# EasyEDA Pro project PrototypeBoardV2A.eprj

# Schematic Schematic1
Board Name: Board1; Create Date: 2025-06-25; Page Name: P1; Project Name: PrototypeBoardV2A; Schematic Name: Schematic1; Update Date: 2025-08-23; Company: m039; Drawn: Dmitry Mozgin; Page Size: A4; Version: V1.0
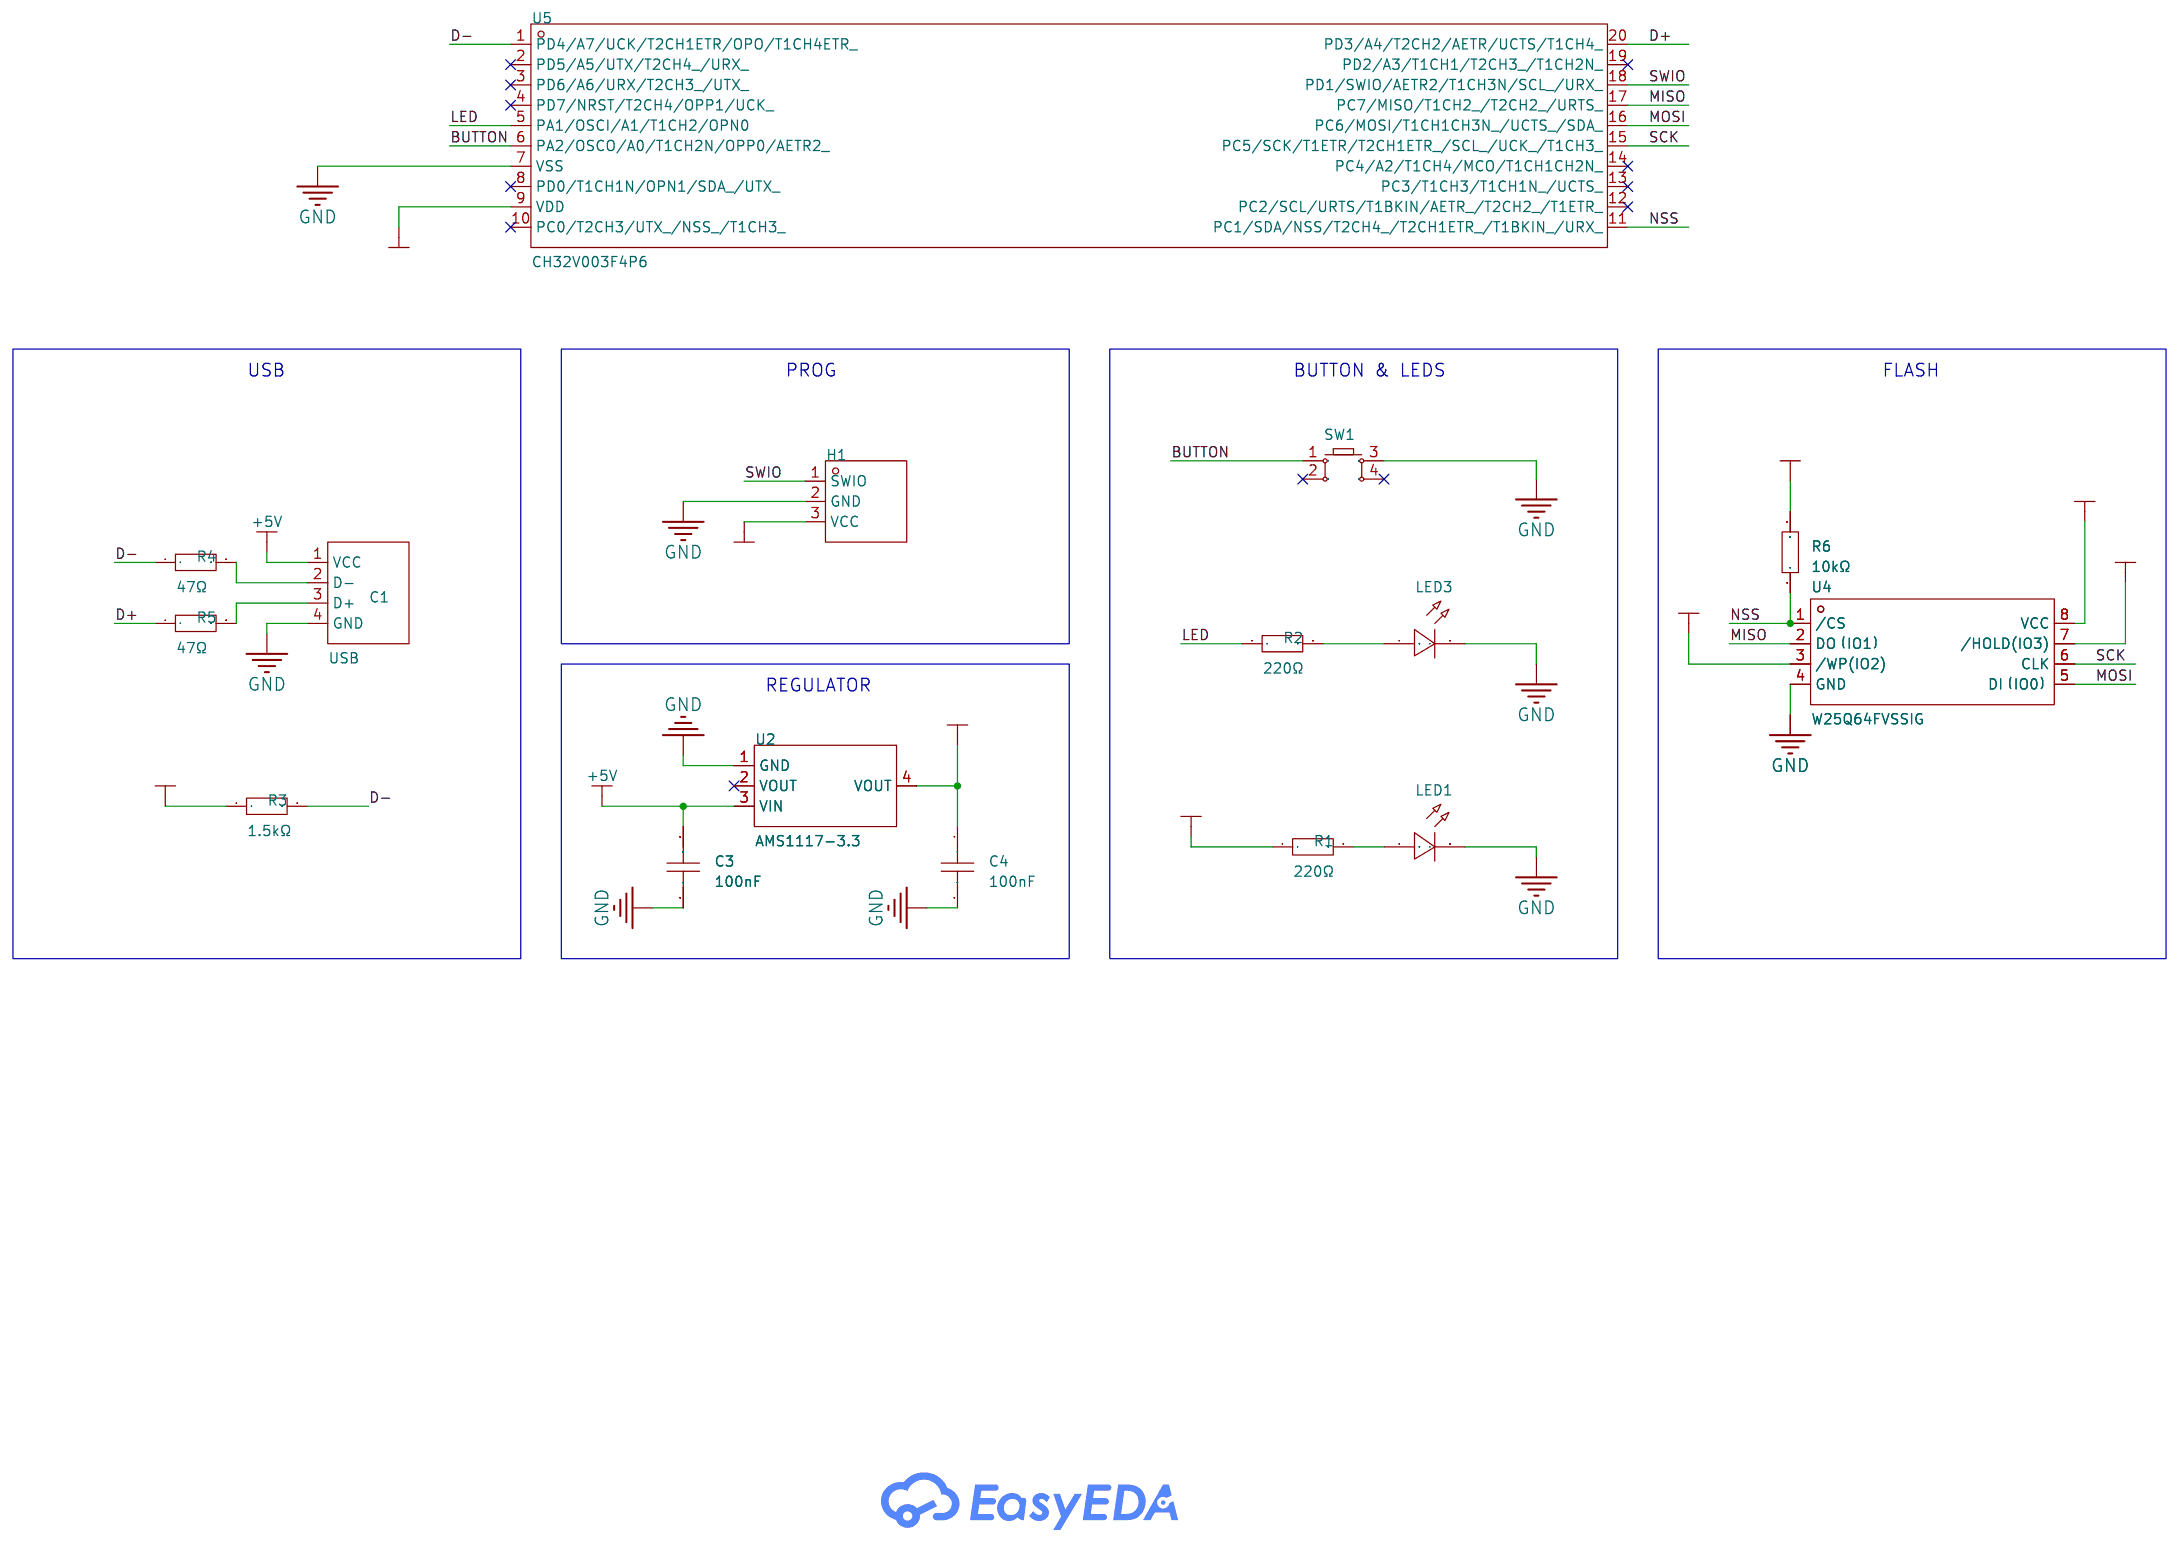
[diagram p0: schematic sheet]

## Parts
C1  USB  [USB Type-C 4P]
C3  100nF  [CAP-TH_L5.8-W3.0-P4.7-D0.45]
C4  100nF  [CAP-TH_L5.8-W3.0-P4.7-D0.45]
H1  -  [HDR-TH_3P-P2.54-V-M]
LED1  -  [LED-TH_BD3.0-P2.54-FD]
LED3  -  [LED-TH_BD3.8-P2.54-FD_BLUE]
R1  220Ω  [RES-TH_BD1.8-L3.2-P7.20-D0.4]
R2  220Ω  [RES-TH_BD1.8-L3.2-P7.20-D0.4]
R3  1.5kΩ  [RES-TH_BD1.8-L3.2-P7.20-D0.4]
R4  47Ω  [RES-TH_BD1.8-L3.2-P7.20-D0.4]
R5  47Ω  [RES-TH_BD1.8-L3.2-P7.20-D0.4]
R6  10kΩ  [RES-TH_BD1.8-L3.2-P7.20-D0.4]
SW1  -  [KEY-TH_4P-L6.0-W6.0-P3.90-LS6.5]
U2  AMS1117-3.3  [SOT-223-3_L6.5-W3.4-P2.30-LS7.0-BR]
U4  W25Q64FVSSIG  [SOIC-8_L5.3-W5.3-P1.27-LS8.0-BL]
U5  CH32V003F4P6  [TSSOP-20_L6.5-W4.4-P0.65-LS6.4-BL]

## Library data of the parts
C1 = USB Type-C 4P Board
C3 C4 = 1C10Z5U104M050B: LCSC Part Name: 100nF ±20% 50V; Supplier Part: C3009699; Manufacturer: VISHAY(威世); Supplier Footprint: 插件,P=10mm; JLCPCB Part Class: Extended Part; Datasheet: https://atta.szlcsc.com/upload/public/pdf/source/20210701/0CF1A7AD3406E72B391D35880AF61B15.pdf; Supplier: LCSC; Tolerance: ±20%; Voltage Rating: 50V; Pin Spacing: 2.54mm; Temperature Coefficient: Z5U; Diameter: 5.08mm; Body Thickness: 3.18mm
H1 = HDR-M_2.54_1x3P: Supplier Footprint: Through
LED1 = LED_TH-R_3mm: Supplier Footprint: Through
LED3 = LED_TH-B_3mm: Supplier Footprint: Through
R1-R6 = Res_AXIAL-1/8W: Supplier Footprint: Through
SW1 = Key_TH_6x6x4.5: Supplier Footprint: Through
U2 = AMS1117-3.3_C6186: LCSC Part Name: 输出3.3V 1A; Supplier Part: C6186; Manufacturer: AMS; Supplier Footprint: SOT-223; JLCPCB Part Class: Basic Part; Datasheet: https://atta.szlcsc.com/upload/public/pdf/source/20180727/C6186_7A095716F0823C02F1997A905E26C086.pdf; Supplier: LCSC; Output Type: Fixed; Voltage - Supply: 16V; Output Voltage: 3.3V; Output Current: 1A; Power Supply Rejection Ratio (PSRR): 72dB@(120Hz); Voltage Dropout: 1.1V@(800mA); standby current: 5mA; Features: Over Current Protection；Over Temperature Protection; Operating Temperature: -40℃~+125℃; Output Configuration: Positive; Number of Outputs: 1
U4 = W25Q64FVSSIG: LCSC Part Name: W25Q64FVSSIG 停产; Supplier Part: C66141; Supplier Footprint: SOIC-8-208mil; JLCPCB Part Class: Extended Part; Supplier: LCSC
U5 = CH32V003F4P6: Supplier Part: C5187096; Manufacturer: WCH(南京沁恒); Supplier Footprint: TSSOP-20-175mil; JLCPCB Part Class: Extended Part; Datasheet: https://atta.szlcsc.com/upload/public/pdf/source/20250604/86DFE64B14CD7099775DB96D45CE90A6.pdf; Supplier: LCSC

## Nets
+3.3V: C4.1 H1.3(VCC) R1.1 R3.1 R6.2 U2.4(VOUT) U4.3(/WP(IO2)) U4.7(/HOLD(IO3)) U4.8(VCC) U5.9(VDD)
+5V: C1.1(VCC) C3.2 U2.3(VIN)
GND: C1.4(GND) C3.1 C4.2 H1.2(GND) LED1.2(A) LED3.2(A) SW1.3 U2.1(GND) U4.4(GND) U5.7(VSS)
BUTTON: SW1.1 U5.6(PA2/OSCO/A0/T1CH2N/OPP0/AETR2_)
D+: R5.1 U5.20(PD3/A4/T2CH2/AETR/UCTS/T1CH4_)
D-: R3.2 R4.1 U5.1(PD4/A7/UCK/T2CH1ETR/OPO/T1CH4ETR_)
LED: R2.1 U5.5(PA1/OSCI/A1/T1CH2/OPN0)
MISO: U4.2(DO（IO1）) U5.17(PC7/MISO/T1CH2_/T2CH2_/URTS_)
MOSI: U4.5(DI（IO0）) U5.16(PC6/MOSI/T1CH1CH3N_/UCTS_/SDA_)
NSS: R6.1 U4.1(/CS) U5.11(PC1/SDA/NSS/T2CH4_/T2CH1ETR_/T1BKIN_/URX_)
SCK: U4.6(CLK) U5.15(PC5/SCK/T1ETR/T2CH1ETR_/SCL_/UCK_/T1CH3_)
SWIO: H1.1(SWIO) U5.18(PD1/SWIO/AETR2/T1CH3N/SCL_/URX_)
$1N1276: LED1.1(C) R1.2
$1N2333: LED3.1(C) R2.2
$1N3479: C1.2(D-) R4.2
$1N3509: C1.3(D+) R5.2

Not connected (* = marked no-connect by the designer): SW1 2* 4*; U2 2(VOUT)*; U5 2(PD5/A5/UTX/T2CH4_/URX_)* 3(PD6/A6/URX/T2CH3_/UTX_)* 4(PD7/NRST/T2CH4/OPP1/UCK_)* 8(PD0/T1CH1N/OPN1/SDA_/UTX_)* 10(PC0/T2CH3/UTX_/NSS_/T1CH3_)* 12(PC2/SCL/URTS/T1BKIN/AETR_/T2CH2_/T1ETR_)* 13(PC3/T1CH3/T1CH1N_/UCTS_)* 14(PC4/A2/T1CH4/MCO/T1CH1CH2N_)* 19(PD2/A3/T1CH1/T2CH3_/T1CH2N_)*

## Notes on the sheet
- USB
- PROG
- BUTTON & LEDS
- FLASH
- REGULATOR

# Board PCB1
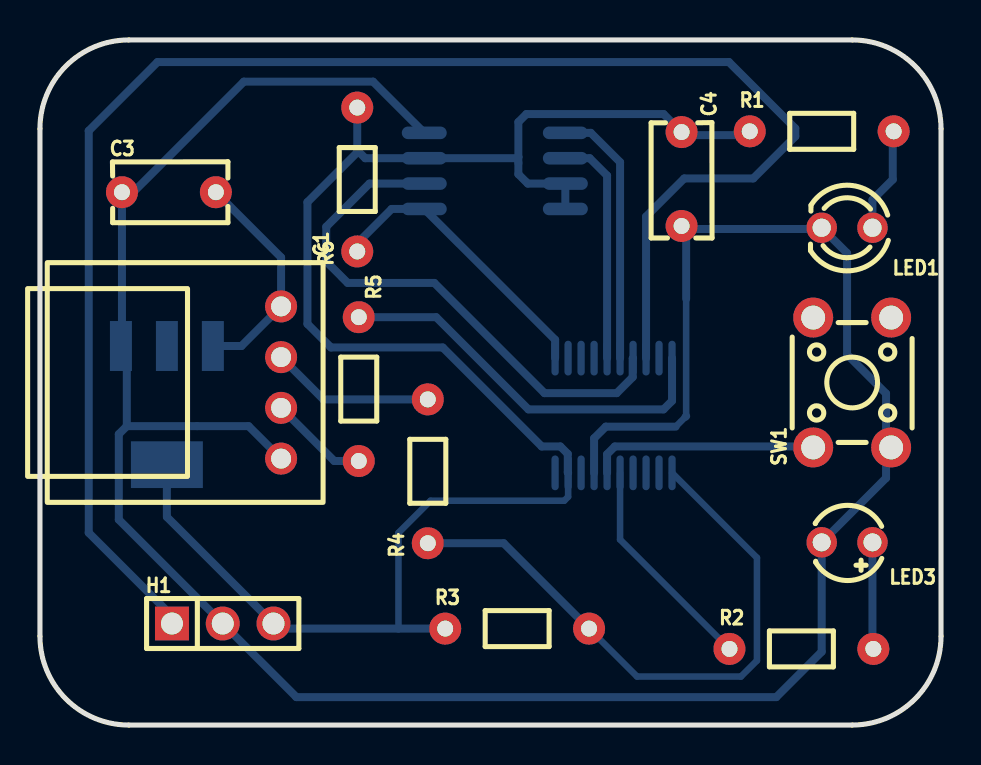
[diagram p1: board, top side]
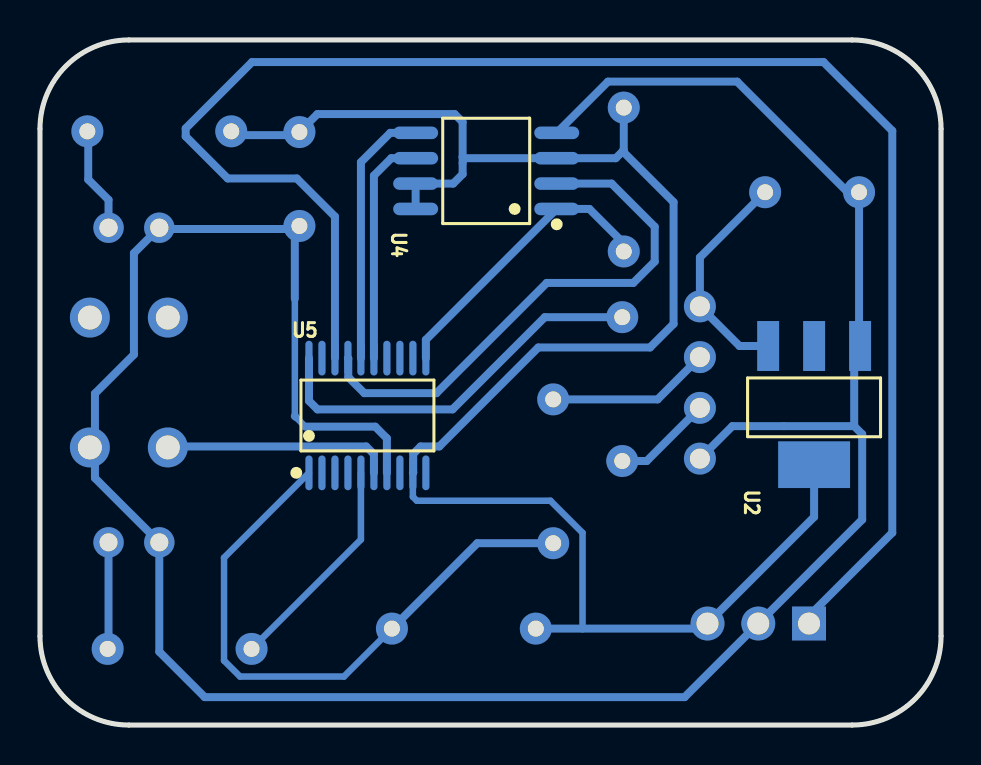
[diagram p2: board, bottom side, seen from below]

Outline 45.09 x 34.29 mm; copper layers: Top Layer, Bottom Layer. Coordinates in mm from the lower left corner of the outline.
Outline path: 0,29.85 0,4.45 arc(1.3,1.3) 4.45,0 40.64,0 arc(43.79,1.3) 45.09,4.45 45.09,29.85 arc(43.79,32.99) 40.64,34.29 4.45,34.29 arc(1.3,32.99) 0,29.85
Stack: Top Layer 0.035mm / Dielectric1 1.51mm FR4 er 4.5 / Bottom Layer 0.035mm

## Design rules (mm)
template: Custom Config
spacing copperThickness1oz (default): track to track 0.2, other pairs 0.152 to 0.3
spacing copperThickness2oz: track to track 0.203, other pairs 0.152 to 0.3
track width copperThickness1oz (default): min 0.127, default 0.4, max 2.54
track width copperThickness2oz: min 0.203, default 0.254, max 2.54
differential pair differentialPair (default): width min 0.127, default 0.254, max 2.54; gap min 0.152, default 0.152
via viaSize (default): diameter min 0.5, default 0.61, max 10; hole min 0.3, default 0.305, max 6.3

## Placement (name value [footprint] x y rotation side)
C1  USB  [USB Type-C 4P]  12.07 17.15 270 top
C3  100nF  [CAP-TH_L5.8-W3.0-P4.7-D0.45]  6.45 26.67 0 top
C4  100nF  [CAP-TH_L5.8-W3.0-P4.7-D0.45]  32.11 27.33 270 top
H1  -  [HDR-TH_3P-P2.54-V-M]  9.15 5.08 0 top
LED1  -  [LED-TH_BD3.0-P2.54-FD]  40.39 24.89 180 top
LED3  -  [LED-TH_BD3.8-P2.54-FD_BLUE]  40.39 9.15 180 top
R1  220Ω  [RES-TH_BD1.8-L3.2-P7.20-D0.4]  39.12 29.72 0 top
R2  220Ω  [RES-TH_BD1.8-L3.2-P7.20-D0.4]  38.1 3.81 0 top
R3  1.5kΩ  [RES-TH_BD1.8-L3.2-P7.20-D0.4]  23.88 4.83 0 top
R4  47Ω  [RES-TH_BD1.8-L3.2-P7.20-D0.4]  19.41 12.7 90 top
R5  47Ω  [RES-TH_BD1.8-L3.2-P7.20-D0.4]  15.95 16.82 270 top
R6  10kΩ  [RES-TH_BD1.8-L3.2-P7.20-D0.4]  15.88 27.31 90 top
SW1  -  [KEY-TH_4P-L6.0-W6.0-P3.90-LS6.5]  40.64 17.15 90 top
U2  AMS1117-3.3  [SOT-223-3_L6.5-W3.4-P2.30-LS7.0-BR]  6.35 16 90 bottom
U4  W25Q64FVSSIG  [SOIC-8_L5.3-W5.3-P1.27-LS8.0-BL]  22.76 27.74 90 bottom
U5  CH32V003F4P6  [TSSOP-20_L6.5-W4.4-P0.65-LS6.4-BL]  28.7 15.5 180 bottom

## Footprints (pads in the part's own frame, mm; a bottom-side part is the same pattern mirrored in y, then rotated)
CAP-TH_L5.8-W3.0-P4.7-D0.45
  round 1.6 hole 0.8: 1(-2.35,0) 2(2.35,0)
HDR-TH_3P-P2.54-V-M
  rect 1.7x1.7 hole 1.1: 1(-2.54,0)
  round 1.7 hole 1.1: 2(0,0) 3(2.54,0)
KEY-TH_4P-L6.0-W6.0-P3.90-LS6.5
  round 2 hole 1.2: 1(-3.25,1.95) 2(3.25,1.95) 3(-3.25,-1.95) 4(3.25,-1.95)
LED-TH_BD3.0-P2.54-FD
  round 1.524 hole 0.914: 1(-1.27,0) 2(1.27,0)
LED-TH_BD3.8-P2.54-FD_BLUE
  round 1.524 hole 0.9: 1(-1.27,0) 2(1.27,0)
RES-TH_BD1.8-L3.2-P7.20-D0.4
  round 1.6 hole 0.8: 1(-3.6,0) 2(3.6,0)
SOIC-8_L5.3-W5.3-P1.27-LS8.0-BL
  oval 0.63x2.25 smd: 1(-1.905,-3.53) 2(-0.635,-3.53) 3(0.635,-3.53) 4(1.905,-3.53) 5(1.905,3.53) 6(0.635,3.53) 7(-0.635,3.53) 8(-1.905,3.53)
SOT-223-3_L6.5-W3.4-P2.30-LS7.0-BR
  rect 2.5x1.1 smd: 1(2.97,-2.3) 2(2.97,0) 3(2.97,2.3)
  rect 2.34x3.6 smd: 4(-2.97,0)
TSSOP-20_L6.5-W4.4-P0.65-LS6.4-BL
  oval 0.364x1.742 smd: 1(-2.925,-2.871) 2(-2.275,-2.871) 3(-1.625,-2.871) 4(-0.975,-2.871) 5(-0.325,-2.871) 6(0.325,-2.871) 7(0.975,-2.871) 8(1.625,-2.871) 9(2.275,-2.871) 10(2.925,-2.871) 11(2.925,2.871) 12(2.275,2.871) 13(1.625,2.871) 14(0.975,2.871) 15(0.325,2.871) 16(-0.325,2.871) 17(-0.975,2.871) 18(-1.625,2.871) 19(-2.275,2.871) 20(-2.925,2.871)
USB Type-C 4P
  round 1.6 hole 1: 1(-3.81,0) 2(-1.27,0) 3(1.27,0) 4(3.81,0)

## Nets
As in the schematic.

Pads without a net: SW1 2 4; U2 2; U5 2 3 4 8 10 12 13 14 19

## Routing (per net, layer and track width the routed paths; a pad name or vN(x,y) marks a point on that pad's centre or on a via; arc(x,y) is an arc through that point)
+3.3V: length 89.9
  Bottom Layer w0.328: 17.94,4.83 17.94,9.62 19.54,11.23 26.23,11.23 26.43,11.42 U5.9
  Bottom Layer w0.4: R3.1 11.94,4.83 H1.3 6.35,10.42 U2.4 ; R1.1 35.33,29.53 32.11,29.53 ; 23.94,28.43 23.88,28.37 U4.3 16.28,28.37 15.93,28.72 ; 23.94,28.43 23.94,30.18 24.34,30.58 31.21,30.58 C4.1 ; 23.94,28.43 23.94,27.57 24.41,27.1 U4.7 U4.8 ; 15.93,28.72 15.88,28.77 R6.2 ; 15.93,28.72 13.38,26.17 13.38,20.08 14.56,18.9 20.15,18.9 25.11,13.95 26.04,13.95 26.41,13.58 26.41,12.64 U5.9 ; 15.85,31.29 15.85,30.91
+5V: length 11.3
  Bottom Layer w0.4: C3.2 12.07,23.41 C1.1 10.08,18.97 U2.3
GND: length 130.6
  Bottom Layer w0.328: 32.34,21.34 32.34,15.46 ; 32.3,15.43 31.81,14.94
  Bottom Layer w0.4: U5.7 27.73,14.35 28.31,14.94 31.81,14.94 ; 32.34,21.34 32.34,24.75 32.26,24.83 ; C4.2 32.26,24.83 ; 32.26,24.83 39.05,24.83 LED1.2 40.39,23.62 40.39,18.54 42.34,16.59 42.34,12.37 LED3.2 39.12,3.67 36.85,1.4 12.83,1.4 H1.2 3.95,10.28 3.95,14.56 4.35,14.96 ; 32.34,15.46 32.3,15.43 ; U4.4 16.67,32.21 10.2,32.21 4.67,26.67 C3.1 4.1,19.02 U2.1 4.35,18.68 4.35,14.96 ; 4.35,14.96 10.44,14.96 C1.4
BUTTON: length 11.3
  Bottom Layer w0.4: U5.6 28.38,13.56 28.77,13.95 38.01,13.95 38.44,13.52
D+: length 19.9
  Bottom Layer w0.4: R5.1 19.83,20.42 24.44,15.8 ; 24.44,15.8 31.2,15.8 31.63,16.23 U5.20
D-: length 30.7
  Bottom Layer w0.328: R3.2 29.88,2.43 35.08,2.43 35.88,3.23 35.88,8.38 U5.1
  Bottom Layer w0.4: R3.2 23.2,9.1 R4.1
LED: length 11.1
  Bottom Layer w0.328: R2.1 29.03,9.28 U5.5
MISO: length 26.9
  Bottom Layer w0.4: U4.2 16.49,27.1 14.33,24.94 14.33,23.2 15.4,22.13 19.73,22.13 25.25,16.61 28.86,16.61 29.66,17.42 29.66,18.35 U5.17
MOSI: length 13.2
  Bottom Layer w0.4: U4.5 27.56,29.64 29.03,28.18 U5.16
NSS: length 14.3
  Bottom Layer w0.4: 15.85,24.09 17.6,25.83 U4.1 25.78,19.28 U5.11
SCK: length 11.6
  Bottom Layer w0.4: U5.15 28.38,27.5 27.51,28.37 U4.6
SWIO: length 81.2
  Bottom Layer w0.4: H1.1 6.61,5.46 2.44,9.62 2.44,29.74 5.88,33.19 34.47,33.19 37.8,29.87 37.8,29.47 35.69,27.36 32.24,27.36 30.33,25.45 U5.18
$1N1276: length 5.3
  Bottom Layer w0.4: R1.2 42.67,29.68 42.67,27.31 41.66,26.29 LED1.1
$1N2333: length 5.4
  Bottom Layer w0.4: LED3.1 41.66,3.86 R2.2
$1N3479: length 8.2
  Bottom Layer w0.4: 12.07,18.42 14.18,16.3 R4.2
$1N3509: length 5
  Bottom Layer w0.4: C1.3 14.73,13.22 R5.2
